# EAGLE design Ver5.1 (EAGLE 9.6.2)
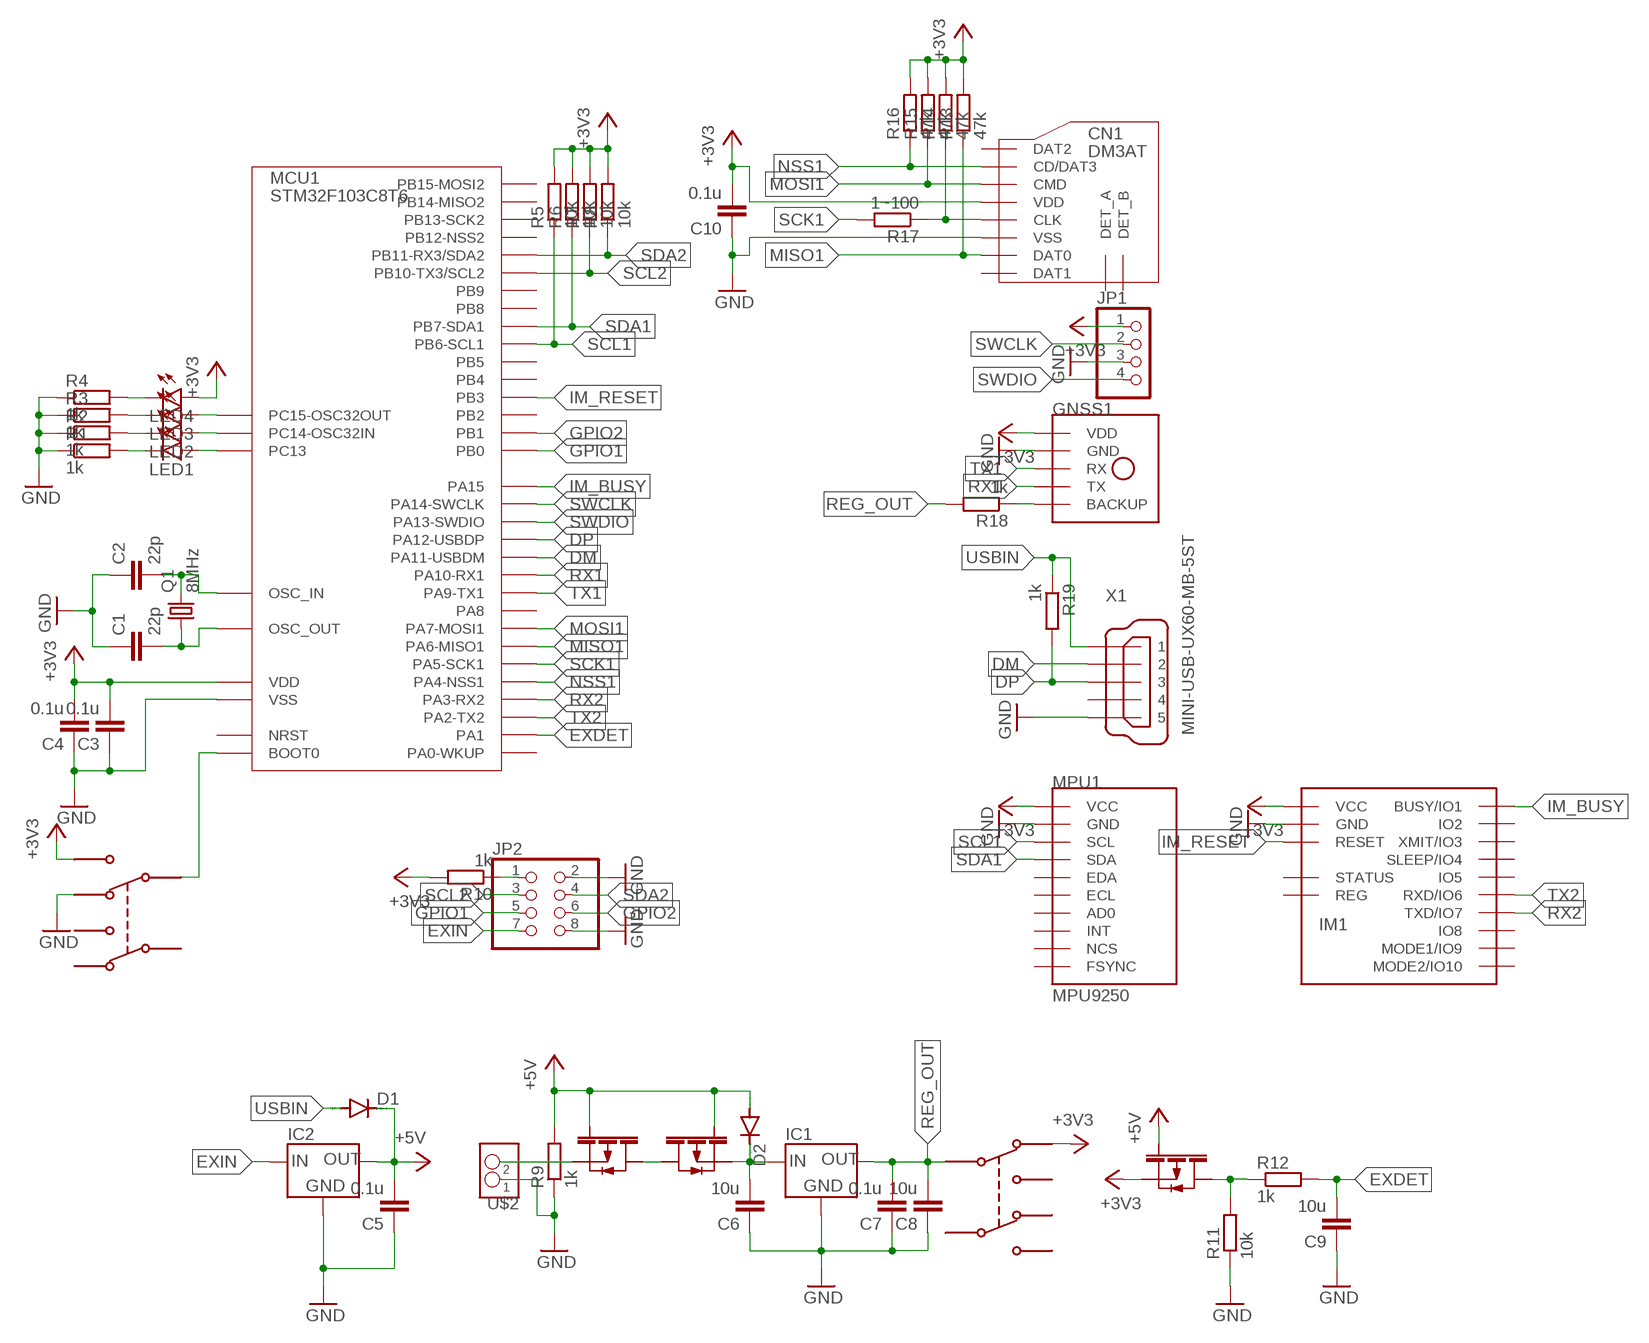
[diagram p0: schematic, sheet 1]

## Parts
C1  22p  C-EUC0805  [C0805]
C2  22p  C-EUC0805  [C0805]
C3  0.1u  C-EUC0805  [C0805]
C4  0.1u  C-EUC0805  [C0805]
C5  0.1u  C-EUC0805  [C0805]
C6  10u  C-EUC0805  [C0805]
C7  0.1u  C-EUC0805  [C0805]
C8  10u  C-EUC0805  [C0805]
C9  10u  C-EUC0805  [C0805]
C10  0.1u  C-EUC0805  [C0805]
CN1  DM3AT  [DM3AT]
D1  DIODE-SOD123  [SOD123]
D2  DIODE-SOD123  [SOD123]
FET1  PCH  [SOT-23]
FET2  PCH  [SOT-23]
FET3  PCH  [SOT-23]
GNSS1  GYSFDMAXB  [GYSFDMAXB]
IC1  LT1117-3.3  [SOT-223]
IC2  LT1117-5  [SOT-223]
IM1  IM920C  [IM920C]
JP1  PINHD-1X4/90  [1X04/90]
JP2  PINHD-2X4  [2X04]
LED1  LEDSML0805  [SML0805]
LED2  LEDSML0805  [SML0805]
LED3  LEDSML0805  [SML0805]
LED4  LEDSML0805  [SML0805]
MCU1  STM32F103C8T6  [LQFP48]
MPU1  MPU9250  [GY-9250]
Q1  8MHz  CRYSTALHC49S  [HC49/S]
R1  1k  R-EU_R0805  [R0805]
R2  1k  R-EU_R0805  [R0805]
R3  1k  R-EU_R0805  [R0805]
R4  1k  R-EU_R0805  [R0805]
R5  10k  R-EU_R0805  [R0805]
R6  10k  R-EU_R0805  [R0805]
R7  10k  R-EU_R0805  [R0805]
R8  10k  R-EU_R0805  [R0805]
R9  1k  R-EU_R0805  [R0805]
R10  1k  R-EU_R0805  [R0805]
R11  10k  R-EU_R0805  [R0805]
R12  1k  R-EU_R0805  [R0805]
R13  47k  R-EU_R0805  [R0805]
R14  47k  R-EU_R0805  [R0805]
R15  47k  R-EU_R0805  [R0805]
R16  47k  R-EU_R0805  [R0805]
R17  1~100  R-EU_R0805  [R0805]
R18  1k  R-EU_R0805  [R0805]
R19  1k  R-EU_R0805  [R0805]
U$1  MSS22D18  [MSS22D18]
U$2  S2B-XH-A  [S2B-XH-A]
U$3  MSS22D18  [MSS22D18]
X1  MINI-USB-UX60-MB-5ST  [UX60-MB-5ST]

## Nets
+3V3 [POWER_L]: C3.2 C4.2 C10.2 CN1.VDD FET3.P$2 GNSS1.P$16(VDD) IM1.$P17(VCC) JP1.1 LED4.A MCU1.1(VDD) MCU1.9(VDD) MCU1.24(VDD) MCU1.36(VDD) MCU1.48(VDD) MPU1.P1(VCC) R5.2 R6.2 R7.2 R8.2 R10.2 R13.2 R14.2 R15.2 R16.2 U$1.P$0 U$3.P$3
+5V [POWER]: C5.2 D1.C D2.A FET1.P$1 FET2.P$1 FET3.P$1 IC2.2(OUT) R9.2
BOOT0 [SIGNAL]: MCU1.44(BOOT0) U$1.P$1
CLK_R [SIGNAL]: CN1.CLK R14.1 R17.1
DM [SIGNAL]: MCU1.32(PA11-USBDM) X1.2
DP [SIGNAL]: MCU1.33(PA12-USBDP) R19.2 X1.3
EXDET [SIGNAL]: C9.2 MCU1.11(PA1) R12.2
EXDET_R [SIGNAL]: FET3.P$3 R11.2 R12.1
EXIN [POWER]: IC2.3(IN) JP2.7
FET_FET [POWER]: FET1.P$3 FET2.P$3
GND [POWER_L]: C1.1 C2.1 C3.1 C4.1 C5.1 C6.1 C7.1 C8.1 C9.1 C10.1 CN1.VSS GNSS1.P$1(GND) GNSS1.P$2(GND) GNSS1.P$7(GND) GNSS1.P$10(GND) GNSS1.P$12(GND) GNSS1.P$19(GND) GNSS1.P$20(GND) IC1.4(GND) IC2.4(GND) IM1.$P18(GND) JP1.3 JP2.2 JP2.8 MCU1.8(VSS) MCU1.23(VSS) MCU1.35(VSS) MCU1.47(VSS) MPU1.P2(GND) R1.1 R2.1 R3.1 R4.1 R9.1 R11.1 U$1.P$2 U$2.P$1 X1.5
GPIO1 [SIGNAL]: JP2.5 MCU1.18(PB0)
GPIO2 [SIGNAL]: JP2.6 MCU1.19(PB1)
GPS_BACKUP [SIGNAL]: GNSS1.P$14(BACKUP) R18.1
IM_BUSY: IM1.$P1(BUSY/IO1) MCU1.38(PA15)
IM_RESET: IM1.$P19(RESET) MCU1.39(PB3)
LED1_R [POWER_L]: LED1.C R1.2
LED2_R [POWER_L]: LED2.C R2.2
LED3_R [POWER_L]: LED3.C R3.2
LED4_R [POWER_L]: LED4.C R4.2
LI_IN [POWER]: FET1.P$2 U$2.P$2
MISO1 [SIGNAL]: CN1.DAT0 MCU1.16(PA6-MISO1) R13.1
MOSI1 [SIGNAL]: CN1.CMD MCU1.17(PA7-MOSI1) R15.1
NSS1 [SIGNAL]: CN1.CD/DAT3 MCU1.14(PA4-NSS1) R16.1
OSC_IN [POWER_L]: C2.2 MCU1.5(OSC_IN) Q1.2
OSC_OUT [POWER_L]: C1.2 MCU1.6(OSC_OUT) Q1.1
PC13_LED [POWER_L]: LED1.A MCU1.2(PC13)
PC14_LED [POWER_L]: LED2.A MCU1.3(PC14-OSC32IN)
PC15_LED [POWER_L]: LED3.A MCU1.4(PC15-OSC32OUT)
REG_IN [POWER]: C6.2 D2.C FET2.P$2 IC1.3(IN)
REG_OUT [POWER_L]: C7.2 C8.2 IC1.1(OUT) IC1.2(OUT) R18.2 U$3.P$4
RX1 [SIGNAL]: GNSS1.P$5(TX) MCU1.31(PA10-RX1)
RX2 [SIGNAL]: IM1.$P7(TXD/IO7) MCU1.13(PA3-RX2)
S3V3 [SIGNAL]: JP2.1 R10.1
SCK1 [SIGNAL]: MCU1.15(PA5-SCK1) R17.2
SCL1 [SIGNAL]: MCU1.42(PB6-SCL1) MPU1.P3(SCL) R5.1
SCL2 [SIGNAL]: JP2.3 MCU1.21(PB10-TX3/SCL2) R7.1
SDA1 [SIGNAL]: MCU1.43(PB7-SDA1) MPU1.P4(SDA) R6.1
SDA2 [SIGNAL]: JP2.4 MCU1.22(PB11-RX3/SDA2) R8.1
SWCLK [SIGNAL]: JP1.2 MCU1.37(PA14-SWCLK)
SWDIO [SIGNAL]: JP1.4 MCU1.34(PA13-SWDIO)
TX1 [SIGNAL]: GNSS1.P$3(RX) MCU1.30(PA9-TX1)
TX2 [SIGNAL]: IM1.$P6(RXD/IO6) MCU1.12(PA2-TX2)
USBIN [POWER]: D1.A R19.1 X1.1
Unconnected: CN1.DAT1 CN1.DAT2 CN1.DET_A CN1.DET_B IM1.$P2(IO2) IM1.$P3(XMIT/IO3) IM1.$P4(SLEEP/IO4) IM1.$P5(IO5) IM1.$P8(IO8) IM1.$P9(MODE1/IO9) IM1.$P10(MODE2/IO10) IM1.$P15(STATUS) IM1.$P16(REG) MCU1.7(NRST) MCU1.10(PA0-WKUP) MCU1.20(PB2) MCU1.25(PB12-NSS2) MCU1.26(PB13-SCK2) MCU1.27(PB14-MISO2) MCU1.28(PB15-MOSI2) MCU1.29(PA8) MCU1.40(PB4) MCU1.41(PB5) MCU1.45(PB8) MCU1.46(PB9) MPU1.P5(EDA) MPU1.P6(ECL) MPU1.P7(AD0) MPU1.P8(INT) MPU1.P9(NCS) MPU1.P10(FSYNC) U$1.P$3 U$1.P$4 U$1.P$5 U$3.P$0 U$3.P$1 U$3.P$2 U$3.P$5 X1.4

## Library data of the parts
C1-C10 = rcl:C-EU: CAPACITOR, European symbol; SPICEPREFIX: C
CN1 = microSD:DM3AT
D1 D2 = diode:DIODE-: DIODE
FET1-FET3 = MOSFET:PCH
GNSS1 = GYSFDMAXB:GYSFDMAXB
IC1 = LT1117:LT1117-3.3
IC2 = LT1117:LT1117-5
IM1 = IM920:IM920C
JP1 = pinhead:PINHD-1X4: PIN HEADER
JP2 = pinhead:PINHD-2X4: PIN HEADER
LED1-LED4 = led:LED: LED OSRAM: - CHIPLED LG R971, LG N971, LY N971, LG Q971, LY Q971, LO R971, LY R971 LH N974, LH R974 LS Q976, LO Q976, LY Q976 LO Q996 - Hyper CHIPLED LW Q18S LB Q993, LB Q99A, LB R99A - SideLED LS A670, LO A670, LY A670, LG A670, LP A670 LB A673, LV A673, LT A673, LW A673 LH A674 LY A675 LS A676, LA A676, LO A676, LY A676, LW A676 LS A679, LY A679, LG A679 - Hyper Micro SIDELED® LS Y876, LA Y876, LO Y876, LY Y876 LT Y87S - SmartLED LW L88C, LW L88S LB L89C, LB L89S, LG L890 LS L89K, LO L89K, LY L89K LS L896, LA L896, LO L896, LY L896 - TOPLED LS T670, LO T670, LY T670, LG T670, LP T670 LSG T670, LSP T670, LSY T670, LOP T670, LYG T670 LG T671, LOG T671, LSG T671 LB T673, LV T673, LT T673, LW T673 LH T674 LS T676, LA T676, LO T676, LY T676, LB T676, LH T676, LSB T676, LW T676 LB T67C, LV T67C, LT T67C, LS T67K, LO T67K, LY T67K, LW E67C LS E67B, LA E67B, LO E67B, LY E67B, LB E67C, LV E67C, LT E67C LW T67C LS T679, LY T679, LG T679 LS T770, LO T770, LY T770, LG T770, LP T770 LB T773, LV T773, LT T773, LW T773 LH T774 LS E675, LA E675, LY E675, LS T675 LS T776, LA T776, LO T776, LY T776, LB T776 LHGB T686 LT T68C, LB T68C - Hyper Mini TOPLED® LB M676 - Mini TOPLED Santana® LG M470 LS M47K, LO M47K, LY M47K Source: http://www.osram.convergy.de LUXEON: - LUMILED® LXK2-PW12-R00, LXK2-PW12-S00, LXK2-PW14-U00, LXK2-PW14-V00 LXK2-PM12-R00, LXK2-PM12-S00, LXK2-PM14-U00 LXK2-PE12-Q00, LXK2-PE12-R00, LXK2-PE12-S00, LXK2-PE14-T00, LXK2-PE14-U00 LXK2-PB12-K00, LXK2-PB12-L00, LXK2-PB12-M00, LXK2-PB14-N00, LXK2-PB14-P00, LXK2-PB14-Q00 LXK2-PR12-L00, LXK2-PR12-M00, LXK2-PR14-Q00, LXK2-PR14-R00 LXK2-PD12-Q00, LXK2-PD12-R00, LXK2-PD12-S00 LXK2-PH12-R00, LXK2-PH12-S00 LXK2-PL12-P00, LXK2-PL12-Q00, LXK2-PL12-R00 Source: www.luxeon.com KINGBRIGHT: KA-3528ASYC Source: www.kingbright.com
MCU1 = STM32F103:STM32F103C8T6
MPU1 = MPU9250:MPU9250
Q1 = crystal:CRYSTAL: CRYSTAL; OC_FARNELL: 1667008; OC_NEWARK: unknown
R1-R19 = rcl:R-EU_: RESISTOR, European symbol; SPICEPREFIX: R
U$1 U$3 = switch-slide:MSS22D18
U$2 = xh2-jst-con:S2B-XH-A
X1 = con-hirose:MINI-USB-: MINI USB Connector Source: http://www.hirose.co.jp/cataloge_hp/e24000019.pdf; OC_FARNELL: unknown; OC_NEWARK: unknown

## Net classes
1 POWER: width 0.61 mm, drill 0.305 mm, clearance 0.152 mm
2 POWER_L: width 0.305 mm, drill 0.305 mm, clearance 0.152 mm
3 SIGNAL: width 0.152 mm, drill 0.305 mm, clearance 0.152 mm

## Board
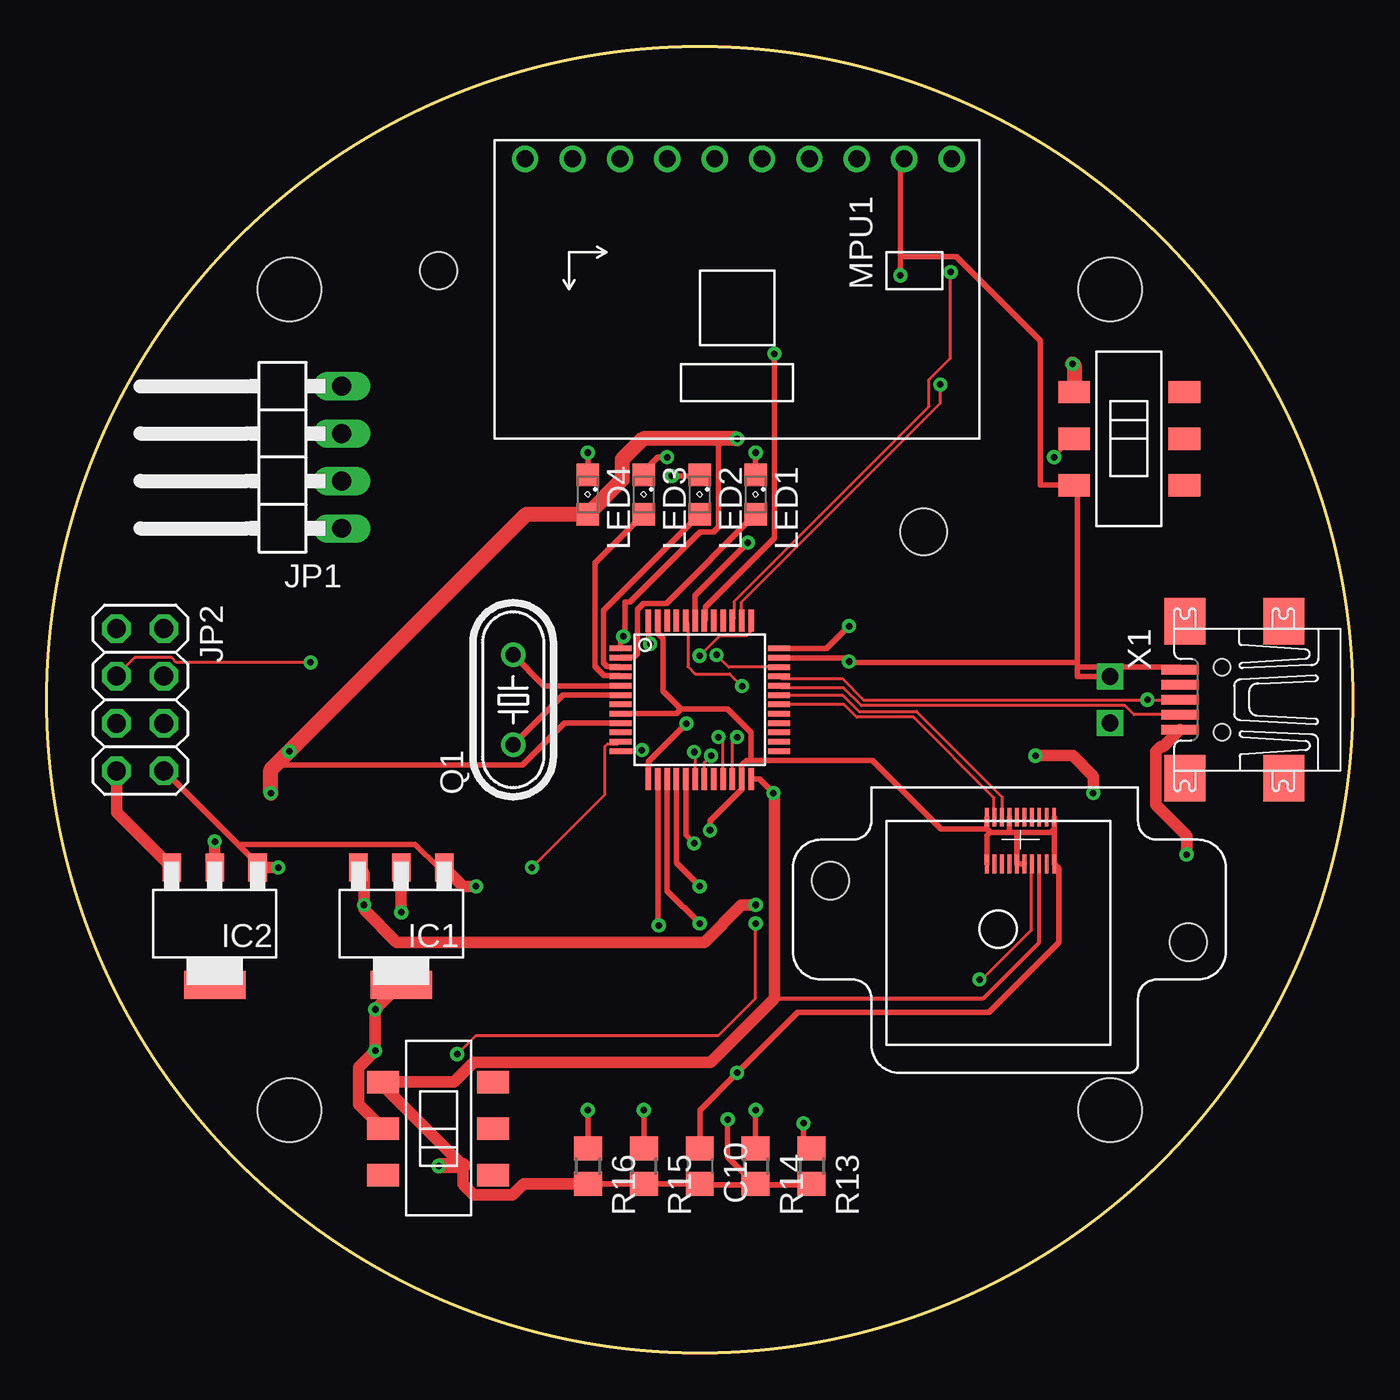
[diagram p1: board, top side]
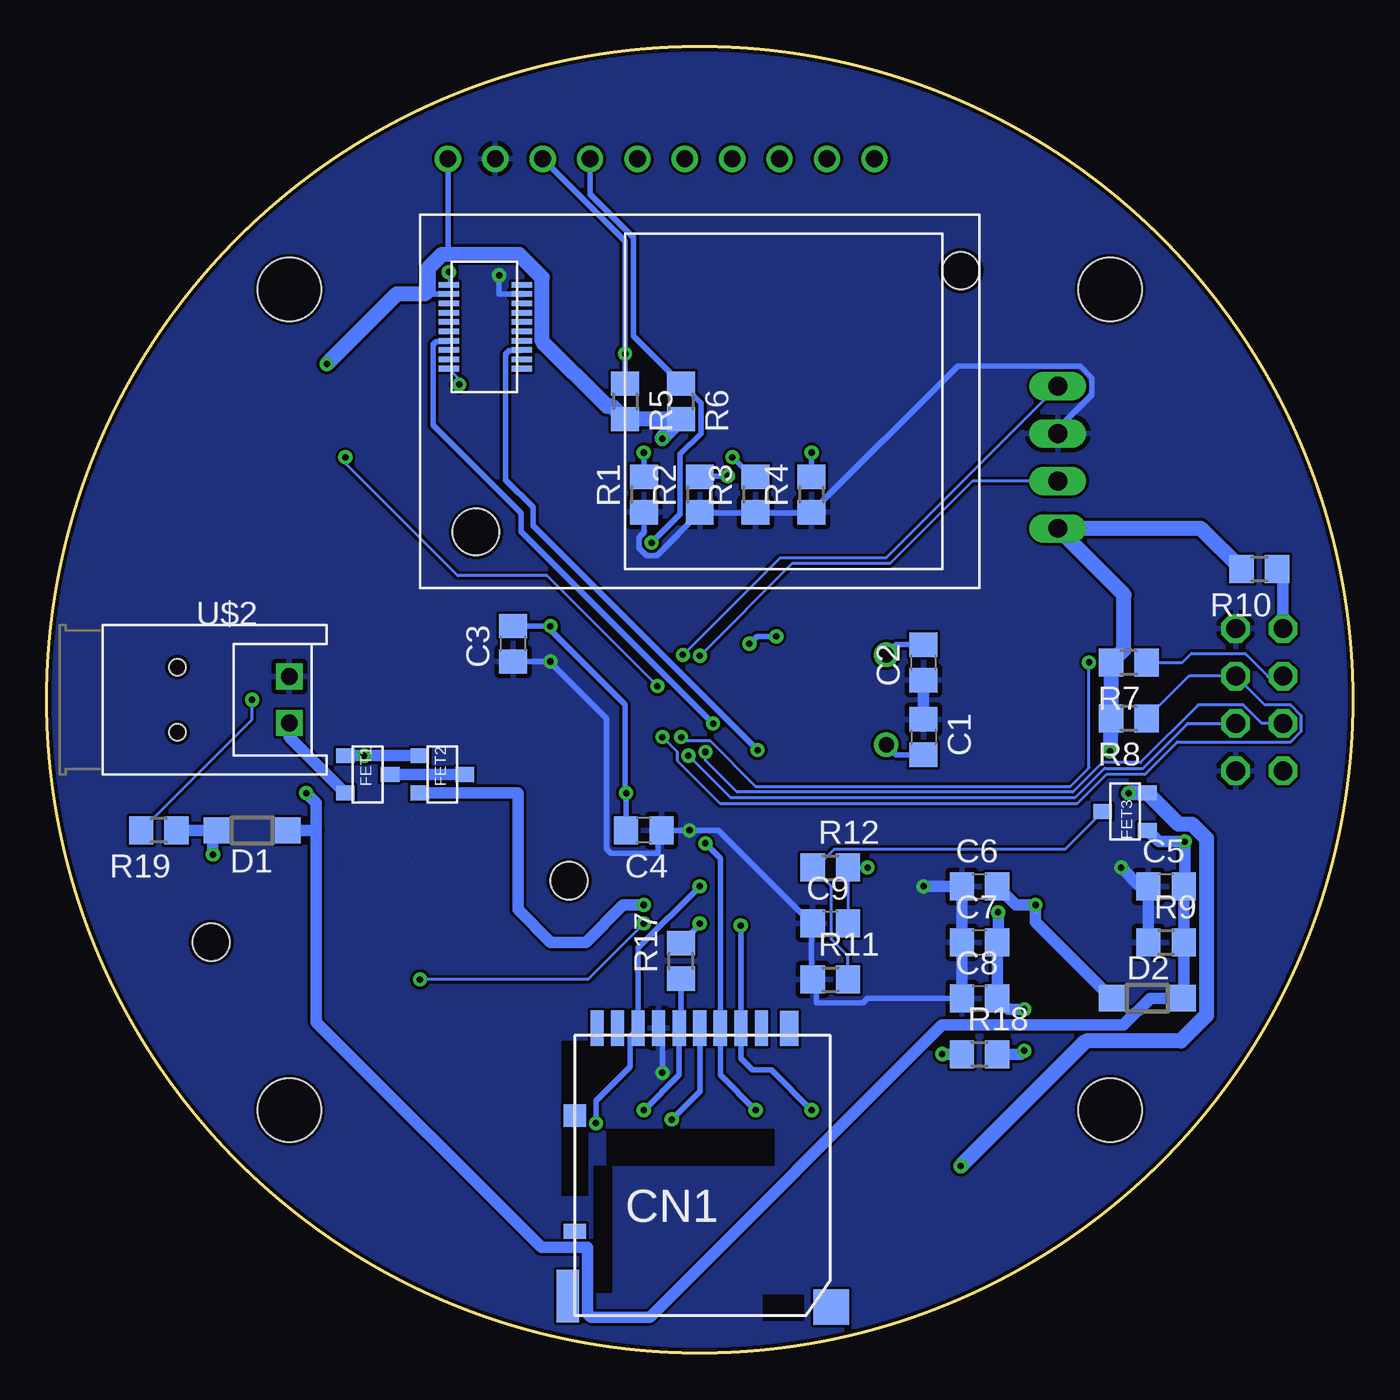
[diagram p2: board, bottom side, seen from below]

Size 70.03 x 70.03 mm. Coordinates in mm from the lower left corner, seen from the top.
Outline: circle at 35.01,35.01 radius 35.01
Copper layers (1*16): Top 0.035mm / dielectric 1.5mm / Bottom 0.035mm
Design rules "PCBGoGo": minimum track width 6mil, minimum drill 0.2mm, track to track 6mil, track to pad 6mil, pad to pad 6mil, via to via 6mil, smd to smd 6mil, copper to edge 0.2mm, drill to drill 6mil, minimum pad ring 10mil, minimum via ring 8mil, stop-mask expansion 4mil, vias tented up to drill 0mil, thermal gap 10mil
Holes 3.4 mm at 13.01,57.01 57.01,57.01 13.01,13.01 57.01,13.01

### Footprints (pad centres in the part's own frame; a part is rotated, then mirrored left to right if it is on the bottom)
C0805 = smd 1.3 x 1.5: 1 -0.95,0; 2 0.95,0
DM3AT = smd 0.7 x 1.9: CD/DAT3 2.2,6.4; CLK -1.1,6.4; CMD 1.1,6.4; DAT0 -3.3,6.4; DAT1 -4.4,6.4; DAT2 3.3,6.4; DET_B -5.5,6.4; VDD 0,6.4; VSS -2.2,6.4 | smd 1.2 x 0.8: DET_A -6.7,-4.5 | smd 1 x 1.9: P$9 4.8,6.381 | smd 1.2 x 1.2: P$11 -6.7,1.7 | smd 1.2 x 2.8: P$13 -7.081,-7.973 | smd 1.9 x 1.9: P$14 7.054,-8.562
SOD123 = smd 1.4 x 1.4: A 1.9,0; C -1.9,0
SOT-23 = smd 0.8 x 1: P$1 -1,0; P$2 1,0; P$3 0,2.4
GYSFDMAXB = smd 0.2 x 1: P$1 8.4,6.7; P$2 8.4,4.2; P$3 8.8,6.7; P$4 8.8,4.2; P$5 9.2,6.7; P$6 9.2,4.2; P$7 9.6,6.7; P$8 9.6,4.2; P$9 10,6.7; P$10 10,4.2; P$11 10.4,6.7; P$12 10.4,4.2; P$13 10.8,6.7; P$14 10.8,4.2; P$15 11.2,6.7; P$16 11.2,4.2; P$17 11.6,6.7; P$18 11.6,4.2; P$19 12,6.7; P$20 12,4.2 | hole 2: 0,3.3; 19.2,0
SOT-223 = smd 3.3 x 1.5: 1 0,3.3 | smd 1 x 1.5: 2 0,-3; 3 2.3,-3; 4 -2.3,-3
IM920C = smd 0.3 x 1.1: $P1 -1.75,-13.45; $P2 -1.75,-9.55; $P3 -2.25,-13.45; $P4 -2.25,-9.55; $P5 -2.75,-13.45; $P6 -2.75,-9.55; $P7 -3.25,-13.45; $P8 -3.25,-9.55; $P9 -3.75,-13.45; $P10 -3.75,-9.55; $P11 -4.25,-13.45; $P12 -4.25,-9.55; $P13 -4.75,-13.45; $P14 -4.75,-9.55; $P15 -5.25,-13.45; $P16 -5.25,-9.55; $P17 -5.75,-13.45; $P18 -5.75,-9.55; $P19 -6.25,-13.45; $P20 -6.25,-9.55 | hole 2.5: 7,-12 | hole 2: -7,14
1X04/90 = drill 1.016 long: 1 -3.81,-3.81; 2 -1.27,-3.81; 3 1.27,-3.81; 4 3.81,-3.81
2X04 = drill 1.016 octagon: 1 -3.81,-1.27; 2 -3.81,1.27; 3 -1.27,-1.27; 4 -1.27,1.27; 5 1.27,-1.27; 6 1.27,1.27; 7 3.81,-1.27; 8 3.81,1.27
SML0805 = smd 1.2 x 1.2: A 1.05,0; C -1.05,0
LQFP48 = smd 0.3 x 1.2: 1 -2.75,-4.25; 2 -2.25,-4.25; 3 -1.75,-4.25; 4 -1.25,-4.25; 5 -0.75,-4.25; 6 -0.25,-4.25; 7 0.25,-4.25; 8 0.75,-4.25; 9 1.25,-4.25; 10 1.75,-4.25; 11 2.25,-4.25; 12 2.75,-4.25; 25 2.75,4.25; 26 2.25,4.25; 27 1.75,4.25; 28 1.25,4.25; 29 0.75,4.25; 30 0.25,4.25; 31 -0.25,4.25; 32 -0.75,4.25; 33 -1.25,4.25; 34 -1.75,4.25; 35 -2.25,4.25; 36 -2.75,4.25 | smd 1.2 x 0.3: 13 4.25,-2.75; 14 4.25,-2.25; 15 4.25,-1.75; 16 4.25,-1.25; 17 4.25,-0.75; 18 4.25,-0.25; 19 4.25,0.25; 20 4.25,0.75; 21 4.25,1.25; 22 4.25,1.75; 23 4.25,2.25; 24 4.25,2.75; 37 -4.25,2.75; 38 -4.25,2.25; 39 -4.25,1.75; 40 -4.25,1.25; 41 -4.25,0.75; 42 -4.25,0.25; 43 -4.25,-0.25; 44 -4.25,-0.75; 45 -4.25,-1.25; 46 -4.25,-1.75; 47 -4.25,-2.25; 48 -4.25,-2.75
GY-9250 = drill 0.9: P1 -7,11.5; P2 -7,8.96; P3 -7,6.42; P4 -7,3.88; P5 -7,1.34; P6 -7,-1.2; P7 -7,-3.74; P8 -7,-6.28; P9 -7,-8.82; P10 -7,-11.36
HC49/S = drill 0.813: 1 -2.413,0; 2 2.413,0
R0805 = smd 1.3 x 1.5: 1 -0.95,0; 2 0.95,0
MSS22D18 = smd 1.2 x 1.7: P$0 -2.492,-2.923; P$1 0.008,-2.923; P$2 2.508,-2.923; P$3 2.508,2.977; P$4 0.008,2.977; P$5 -2.492,2.977
S2B-XH-A = drill 0.9 square: P$1 0,1.25; P$2 0,-1.25
UX60-MB-5ST = smd 2 x 0.5: 1 2.25,1.6; 2 2.25,0.8; 3 2.25,0; 4 2.25,-0.8; 5 2.25,-1.6 | smd 2.2 x 2.5: M1 -3.3,-4.2; M2 -3.3,4.2; M3 2,4.2; M4 2,-4.2 | hole 0.9: 0,-1.75; 0,1.75

### Placement (x,y rotation side)
C1  23.01,33.01 270 bottom
C2  23.01,37.01 90 bottom
C3  45.01,38.01 90 bottom
C4  38.01,28.01 180 bottom
C5  10.01,25.01 0 bottom
C6  20.01,25.01 0 bottom
C7  20.01,22.01 0 bottom
C8  20.01,19.01 0 bottom
C9  28.01,23.01 0 bottom
C10  35.01,10.01 270 top
CN1  35.01,11.01 0 bottom
D1  59.01,28.01 180 bottom
D2  11.01,19.01 0 bottom
FET1  54.01,31.01 270 bottom
FET2  50.01,31.01 270 bottom
FET3  11.01,29.01 90 bottom
GNSS1  42.01,22.01 0 top
IC1  19.01,23.01 180 top
IC2  9.01,23.01 180 top
IM1  35.01,51.01 270 bottom
JP1  12.01,48.01 90 top
JP2  5.01,35.01 270 top
LED1  38.01,46.01 270 top
LED2  35.01,46.01 270 top
LED3  32.01,46.01 270 top
LED4  29.01,46.01 270 top
MCU1  35.01,35.01 270 top
MPU1  37.01,57.01 270 top
Q1  25.01,35.01 90 top
R1  38.01,46.01 90 bottom
R2  35.01,46.01 90 bottom
R3  32.01,46.01 90 bottom
R4  29.01,46.01 90 bottom
R5  39.01,51.01 270 bottom
R6  36.01,51.01 270 bottom
R7  12.01,37.01 180 bottom
R8  12.01,34.01 180 bottom
R9  10.01,22.01 0 bottom
R10  5.01,42.01 180 bottom
R11  28.01,20.01 0 bottom
R12  28.01,26.01 0 bottom
R13  41.01,10.01 270 top
R14  38.01,10.01 270 top
R15  32.01,10.01 270 top
R16  29.01,10.01 270 top
R17  36.01,21.01 90 bottom
R18  20.01,16.01 0 bottom
R19  64.01,28.01 180 bottom
U$1  58.01,49.01 270 top
U$2  57.01,35.01 0 bottom
U$3  21.01,12.01 90 top
X1  63.01,35.01 180 top

### Tracks (layer width: path | path; a pad name or v marks a point on that pad's centre or on a via)
+3V3  (via drill 0.35)
  Top 0.203: GNSS1.P$16 53.21,22.01 50.21,19.01 39.01,19.01
  Top 0.305: v36.51,12.51 36.51,10.51 38.01,9.01 | 38.01,9.01 35.06,9.01 C10.2 R15.2 R16.2 | R13.2 40.96,9.01 38.06,9.01 R14.2 38.01,9.01 | MCU1.36 41.81,37.76 v43.01,38.96 | MCU1.24 38.21,30.76 v38.96,30.01 | MCU1.1 30.76,38.26 v30.91,38.41 31.01,38.51 31.01,40.26 31.26,40.26 35.01,44.01 35.76,44.01 36.01,44.26 36.01,49.01 | v32.35,38.01 32.26,38.1 MCU1.48 | MCU1.9 27.76,33.76 25.51,31.51 12.76,31.51 12.52,31.76
  Top 0.61: R16.2 25.58,9.06 24.98,8.47 22.9,8.47 22.33,9.03 22.33,10.03 18.04,14.32 U$3.P$3 21.84,14.52 22.9,15.58 35.58,15.58 39.01,19.01 39.01,29.96 v38.96,30.01
  Top 0.813: v55.01,53.01 55.09,52.94 U$1.P$0 | v37.01,49.01 36.01,49.01 31.97,49.01 30.86,47.9 30.86,46.81 LED4.A 25.73,44.96 v13.01,32.25 12.52,31.76 12.01,31.25 v12.01,30.01 | 22.33,10.03 22.32,10.01 v21.01,10.01
  Bottom 0.305: CN1.VDD 35.01,14.01 v36.51,12.51 | v30.91,38.41 31.95,38.41 v32.35,38.01 | IM1.$P17 49.76,56.76 | C3.2 v43.01,38.96 43.01,38.76 39.01,34.76 39.01,30.01 v38.96,30.01 C4.2 | 48.51,58.88 MPU1.P1 | 13.01,32.28 v13.01,32.25
  Bottom 0.813: v55.01,53.01 51.26,56.76 49.76,56.76 49.57,56.96 49.57,58.16 48.85,58.88 48.51,58.88 44.69,58.88 43.46,57.65 43.46,54.22 40,50.76 39.71,50.76 R5.2 R6.2 37.01,49.06 v37.01,49.01 | R10.2 8.15,44.2 JP1.1 12.27,40.65 12.27,37.71 R7.2 R8.2 13.01,33.96 13.01,32.28 | v21.01,10.01 14.31,16.72 9.22,16.72 7.86,18.08 7.86,27.58 8.63,28.35 9.35,28.35 FET3.P$2 v12.01,30.01
+5V  (via drill 0.35)
  Top 0.61: v9.01,27.41 IC2.2 | v53.01,32.01 55.01,32.01 56.11,30.91 v56.11,30.01
  Bottom 0.61: v56.11,30.01 55.57,29.47 55.57,28.01 | 55.57,28.01 55.57,17.73 43.5,5.66 41.02,5.66 41.02,2.09 40.84,1.91 37.69,1.91 22.02,17.58 12.3,17.58 10.87,19.01 D2.A 9.06,19.06 R9.2 C5.2 9.01,25.06 v9.01,27.41 10.41,27.41 FET3.P$1 | FET2.P$1 v53.01,32.01 FET1.P$1 | D1.C 55.57,28.01
BOOT0  (via drill 0.35)
  Top 0.152: MCU1.44 34.38,39.15 34.38,36.79 34.76,36.41 36.62,36.41 v37.28,35.75 | v54.01,48.01 55.01,49.01 U$1.P$1
  Bottom 0.152: v37.28,35.75 43.2,41.67 47.98,41.67 54.01,47.7 v54.01,48.01
CLK_R  (via drill 0.35)
  Top 0.305: v38.01,13.01 R14.1
  Bottom 0.305: R17.1 36.01,17.51 CN1.CLK 36.11,14.91 v38.01,13.01
DM
  Top 0.152: MCU1.32 39.38,35.65 42.72,35.65 43.67,34.7 57.81,34.7 58.3,34.21 X1.2
DP  (via drill 0.35)
  Top 0.152: MCU1.33 39.39,36.14 42.66,36.14 43.78,35.01 v59.01,35.01 X1.3
  Bottom 0.152: R19.2 59.01,33.96 v59.01,35.01
EXDET  (via drill 0.35)
  Top 0.152: MCU1.11 30.65,32.65 30.07,32.65 29.94,32.51 29.94,29.94 v26.01,26.01
  Bottom 0.152: C9.2 R12.2 v26.01,26.01
EXDET_R
  Bottom 0.152: FET3.P$3 15.44,26.99 27.81,26.99 28.79,26.01 R12.1 27.94,24.99 27.94,22.17 27.06,21.29 R11.2
EXIN
  Top 0.61: IC2.3 3.74,28.98 JP2.7
FET_FET
  Bottom 0.61: FET2.P$3 FET1.P$3
GND  (via drill 0.35)  (3 unrouted)
  Top 0.305: C10.1 35.01,13.01 v37.01,15.01 40.26,18.26 50.51,18.26 54.26,22.01 54.26,25.96 GNSS1.P$20 | MCU1.35 42.81,37.26 v43.01,37.06 43.01,37.01 55.26,37.01 | v35.56,28.01 35.56,28.51 37.26,30.21 MCU1.23 37.26,31.51 37.51,31.76 37.76,31.76 | 45.76,58.76 45.76,64.01 MPU1.P2 | 45.76,58.76 v45.76,57.76 | 55.26,36.76 55.26,36.26 U$2.P$1 | 55.26,36.76 55.26,37.01 | 55.26,37.01 55.26,46.26 U$1.P$2 55.01,46.51 53.26,46.51 53.26,54.26 48.76,58.76 45.76,58.76 | 55.26,36.76 60.76,36.76 X1.5 | 10.26,27.26 11.26,26.26 IC2.4 | 10.26,27.26 6.51,31.01 JP2.8 6.26,31.26 | 10.26,27.26 19.76,27.26 21.01,26.01 IC1.4 | MCU1.8 33.76,34.26 34.01,34.51 | 34.01,34.51 36.51,34.51 37.76,33.26 37.76,31.76 | 37.76,31.76 44.26,31.76 47.94,28.09 50.41,28.09 | MCU1.47 32.76,38.57 33.04,38.3 33.04,35.49 34.01,34.51 | GNSS1.P$20 54.01,28.01 | 54.01,28.01 GNSS1.P$19 | 54.01,28.01 53.95,28.01 53.84,27.91 52.01,27.91 | 50.41,28.09 50.59,27.91 | GNSS1.P$1 50.41,28.09 | 52.01,27.91 51.61,27.91 | 51.61,27.91 50.59,27.91 | GNSS1.P$7 51.61,27.91 | 50.59,27.91 50.41,27.73 GNSS1.P$2 | GNSS1.P$12 GNSS1.P$10 52.01,27.91
  Top 0.61: IC2.4 v12.41,26.01 | IC1.4 22.31,25.01 v23.01,25.01
  Bottom 0.305: v37.01,15.01 37.01,17.21 CN1.VSS | C3.1 v43.01,37.06 43.01,37.01 40.01,34.01 40.01,27.01 39.76,26.76 37.26,26.76 37.26,28.01 v35.56,28.01 34.01,28.01 29.01,23.01 | IM1.$P18 45.76,56.76 v45.76,57.76 | 32.01,45.01 29.01,45.01 R4.1 | 32.01,45.01 34.76,45.01 | 34.76,45.01 35.01,45.01 | 35.01,45.01 R2.1 34.76,45.01 | 32.01,45.01 R3.1 | 38.01,45.01 R1.1 38.01,43.98 38.27,43.72 38.27,43.16 37.87,42.75 37.31,42.75 35.05,45.01 35.01,45.01 | 22.76,36.01 C2.1 | 29.01,45.26 R4.1 | 29.01,23.01 29.01,20.01 R11.1 28.76,20.01 28.76,18.76 26.26,18.76 26.01,19.01 C8.1 | 29.01,23.01 C9.1 | JP1.3 15.82,49.55 14,51.38 14,52.27 14.62,52.89 21.19,52.89 R4.1
  Bottom 0.61: C6.1 21.06,25.11 | C6.1 C7.1 C8.1 | v12.41,26.01 11.41,25.01 C5.1 R9.1 | C2.1 C1.1 | v23.01,25.01 C6.1
  pour Bottom: 0.01,70.01 0.01,0.01 70.01,0.01 70.01,70.01
GPIO1  (via drill 0.35)
  Top 0.152: v34.71,32.21 34.76,32.16 MCU1.18
  Bottom 0.152: JP2.5 4.88,33.74 5.87,34.74 8.29,34.74 11.39,31.64 13.44,31.64 15.01,30.07 33.01,30.07 34.71,31.77 v34.71,32.21
GPIO2  (via drill 0.35)
  Top 0.152: MCU1.19 35.26,31.66 v35.62,32.01
  Bottom 0.152: JP2.6 8.85,33.74 11.26,31.34 13.31,31.34 14.89,29.76 33.37,29.76 v35.62,32.01
GPS_BACKUP  (via drill 0.35)
  Top 0.152: v22.01,16.01 23.01,17.01 36.01,17.01 38.01,19.01 v38.01,23.01 | GNSS1.P$14 52.8,26.2 52.8,22.67 50.14,20.01 v50.01,20.01
  Bottom 0.152: v38.01,23.01 41.01,20.01 v50.01,20.01
  Bottom 0.61: R18.1 v22.01,16.01
IM_BUSY  (via drill 0.35)
  Top 0.152: MCU1.38 37.26,40.26 47.91,50.91 v47.91,51.91
  Bottom 0.152: v47.91,51.91 47.91,52.21 IM1.$P1
IM_RESET  (via drill 0.35)
  Top 0.152: MCU1.39 36.89,39.39 36.89,40.32 47.31,50.74 47.31,52.17 48.46,53.32 v48.46,57.95
  Bottom 0.152: v48.46,57.95 IM1.$P19
LED1_R  (via drill 0.35)
  Top 0.305: v38.01,48.26 LED1.C
  Bottom 0.305: R1.2 v38.01,48.26
LED2_R  (via drill 0.35)
  Top 0.305: v33.51,47.01 35.01,47.01 LED2.C
  Bottom 0.305: v33.51,47.01 35.01,47.01 R2.2
LED3_R  (via drill 0.35)
  Top 0.305: v33.26,48.01 32.76,48.01 32.01,47.26 LED3.C
  Bottom 0.305: v33.26,48.01 32.01,46.76 R3.2
LED4_R  (via drill 0.35)
  Top 0.305: v29.01,48.26 LED4.C
  Bottom 0.305: R4.2 v29.01,48.26
LI_IN
  Bottom 0.61: FET1.P$2 57.01,33.01 U$2.P$2
MISO1  (via drill 0.35)
  Top 0.305: MCU1.16 33.76,26.26 v35.01,25.01 | R13.1 40.58,11.4 v40.58,12.31
  Bottom 0.305: v35.01,25.01 38.31,21.71 CN1.DAT0 38.76,16.97 38.76,15.34 40.58,13.51 v40.58,12.31
MOSI1  (via drill 0.35)
  Top 0.305: MCU1.17 34.26,27.76 v34.71,27.31 | R15.1 v32.01,13.01
  Bottom 0.305: v34.71,27.31 33.91,26.51 CN1.CMD 33.91,14.91 v32.01,13.01
NSS1  (via drill 0.35)
  Top 0.305: MCU1.14 32.76,22.96 v32.81,22.91 | R16.1 v29.01,13.01
  Bottom 0.305: v32.81,22.91 CN1.CD/DAT3 32.81,15.78 32.19,15.16 31.16,15.16 v29.01,13.01
OSC_IN
  Top 0.305: MCU1.5 26.68,35.76 Q1.2
  Bottom 0.305: Q1.2 24.48,37.96 C2.2
OSC_OUT
  Top 0.305: MCU1.6 27.68,35.26 Q1.1
  Bottom 0.305: C1.2 24.48,32.06 Q1.1
PC13_LED
  Top 0.305: LED1.A 33.22,40.17 31.99,40.17 31.67,39.85 31.67,37.49 31.49,37.31 30.81,37.31 MCU1.2
PC14_LED
  Top 0.305: MCU1.3 30.72,36.81 30.04,36.81 29.86,36.99 29.86,39.81 LED2.A
PC15_LED
  Top 0.305: MCU1.4 30.72,36.31 29.89,36.31 29.4,36.8 29.4,42.35 LED3.A
REG_IN  (via drill 0.35)
  Top 0.61: IC1.3 17.01,25.71 v17.01,24.01 17.01,23.76 18.76,22.01 35.26,22.01 37.26,24.01 v38.01,24.01
  Bottom 0.61: C6.2 18.06,24.01 v17.01,24.01 17.01,23.11 D2.C | FET2.P$2 44.76,30.01 44.76,23.76 43.01,22.01 41.11,22.01 39.11,24.01 v38.01,24.01
REG_OUT  (via drill 0.35)
  Top 0.61: IC1.1 18.91,19.71 v17.61,18.41 v17.61,16.2 16.73,15.31 16.73,13.33 U$3.P$4 | v19.01,23.61 IC1.2
  Bottom 0.61: v17.61,18.41 18.46,18.41 C8.2 C7.2 19.01,22.06 v19.01,23.61 | R18.2 17.8,16.01 v17.61,16.2
RX1
  Top 0.152: GNSS1.P$5 51.21,29.81 46.64,34.39 43.54,34.39 42.67,35.26 MCU1.31
RX2  (via drill 0.35)
  Top 0.305: v34.3,33.73 32.26,31.7 MCU1.13
  Bottom 0.305: v34.3,33.73 44.6,44.03 44.6,45.02 49.32,49.74 49.32,54.04 49.14,54.22 48.51,54.22 IM1.$P7
S3V3
  Bottom 0.61: R10.1 3.74,41.69 JP2.1
SCK1  (via drill 0.35)
  Top 0.305: v35.01,23.01 33.26,24.76 MCU1.15
  Bottom 0.305: R17.2 35.01,22.96 v35.01,23.01
SCL1  (via drill 0.35)
  Top 0.305: MCU1.42 35.31,39.31 35.31,39.99 39.01,43.7 v39.01,53.56
  Bottom 0.305: MPU1.P3 39.01,59.59 v39.01,53.56 R5.1
SCL2  (via drill 0.35)
  Top 0.152: MCU1.21 36.26,32.76 v36.01,33.01 | v14.15,37.01 6.96,37.01 6.69,37.28 4.74,37.28 JP2.3
  Bottom 0.152: 4.56,36.28 5.78,37.5 8.65,37.5 9.14,37.01 R7.1 | v36.01,33.01 35.82,32.82 34.46,32.82 32.02,30.37 15.14,30.37 14.15,31.37 v14.15,37.01
  Bottom 0.203: 4.56,36.28 JP2.3
SDA1  (via drill 0.35)
  Top 0.305: MCU1.43 34.76,40.61 v37.59,43.44
  Bottom 0.305: v37.59,43.44 36.07,44.96 36.07,48.18 34.96,49.29 34.96,50.91 R6.1 38.56,54.51 38.56,59.78 40.89,62.12 MPU1.P4
SDA2  (via drill 0.35)
  Top 0.152: MCU1.22 36.76,32.76 v37.01,33.01
  Bottom 0.152: R8.1 8.79,36.28 JP2.4 4.74,34.74 3.33,34.74 2.75,34.15 2.75,33.33 3.33,32.75 9.41,32.75 11.13,31.03 13.19,31.03 14.76,29.46 33.93,29.46 36.23,31.76 36.23,32.23 v37.01,33.01
SWCLK  (via drill 0.35)
  Top 0.152: v35.01,37.37 36.07,38.44 37.51,38.44 37.76,38.69 MCU1.37
  Bottom 0.152: v35.01,37.37 30.06,42.32 24.81,42.32 20.39,46.74 JP1.2
SWDIO  (via drill 0.35)
  Top 0.152: MCU1.34 36.56,36.76 v35.91,37.41
  Bottom 0.152: JP1.4 25.02,42.62 30.7,42.62 v35.91,37.41
TX1
  Top 0.152: MCU1.30 42.74,34.76 43.42,34.09 46.46,34.09 50.79,29.76 50.79,28.74 GNSS1.P$3
TX2  (via drill 0.35)
  Top 0.305: v31.91,32.31 31.86,32.26 MCU1.12
  Bottom 0.305: v31.91,32.31 43.96,44.36 43.96,45.34 45.42,46.8 45.42,53.54 45.24,53.72 44.61,53.72 IM1.$P6
USBIN  (via drill 0.35)
  Top 0.61: X1.1 59.87,32.52 59.73,32.52 59.46,32.25 59.46,29.38 61.11,27.72 v61.11,26.71
  Bottom 0.61: R19.1 D1.A 61.11,27.81 v61.11,26.71